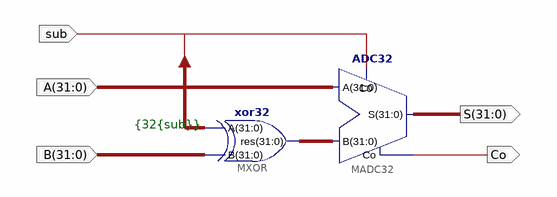
[diagram p0: schematic sheet 1]
// Xilinx ISE schematic ABC32.sch (kintex7) as structural Verilog: 2 symbols, 5 ports
module ABC32 (
  input  [31:0] A,
  input  [31:0] B,
  input  sub,
  output [31:0] S,
  output Co
);

  wire [31:0] XLXN_1;

  xor32 MXOR (.A({32{sub}}), .B(B), .res(XLXN_1));
  ADC32 MADC32 (.B(XLXN_1), .A(A), .C0(sub), .S(S), .Co(Co));

  // Notes on the sheet:
  //   {32{sub}}
endmodule
